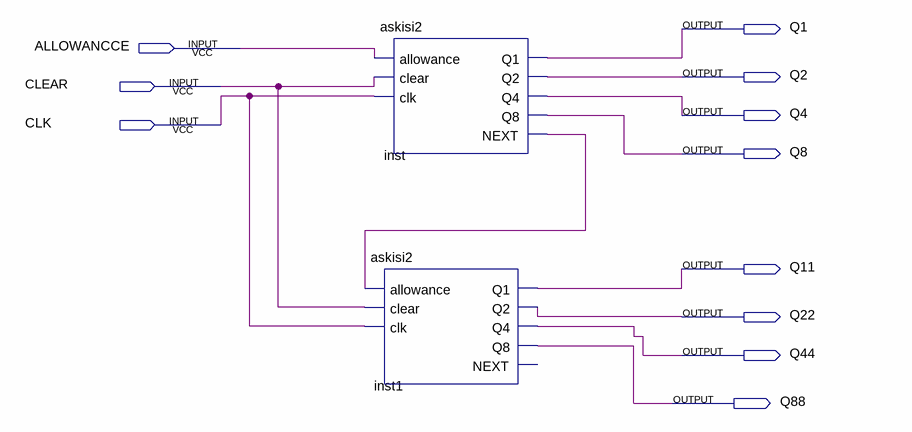
[diagram p0: schematic sheet]
// Quartus schematic Block3.bdf as structural Verilog: 2 symbols, 11 pins
module Block3 (
  input  ALLOWANCCE,
  input  CLEAR,
  input  CLK,
  output Q1,
  output Q2,
  output Q4,
  output Q8,
  output Q11,
  output Q22,
  output Q44,
  output Q88
);

  wire inst_next;

  askisi2 inst1 (
    .allowance(inst_next), .clear(CLEAR), .clk(CLK), .Q1(Q11), .Q2(Q22), .Q4(Q44), .Q8(Q88));  // open: NEXT
  askisi2 inst (.allowance(ALLOWANCCE), .clear(CLEAR), .clk(CLK), .Q1(Q1), .Q2(Q2), .Q4(Q4), .Q8(Q8), .NEXT(inst_next));
endmodule
